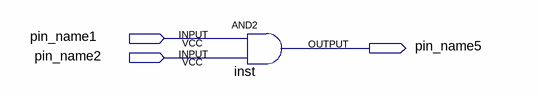
[diagram p0: schematic sheet]
// Quartus schematic GateDemo.bdf as structural Verilog: 1 symbols, 3 pins
module GateDemo (
  input  pin_name1,
  input  pin_name2,
  output pin_name5
);

  and inst (pin_name5, pin_name1, pin_name2);
endmodule
